# EasyEDA Pro project TBAG_TGT.eprj

# Schematic Schematic1
Create Date: 2024-01-03; Page Name: P1; Project Name: test; Schematic Name: Schematic1; Update Date: 2024-01-03; Company: EasyEDA.com; Drawed: EasyEDA Pro; Page Size: A4; Part Number: JLCPCB-002; Reviewed: EasyEDA Pro; Version: V0.1
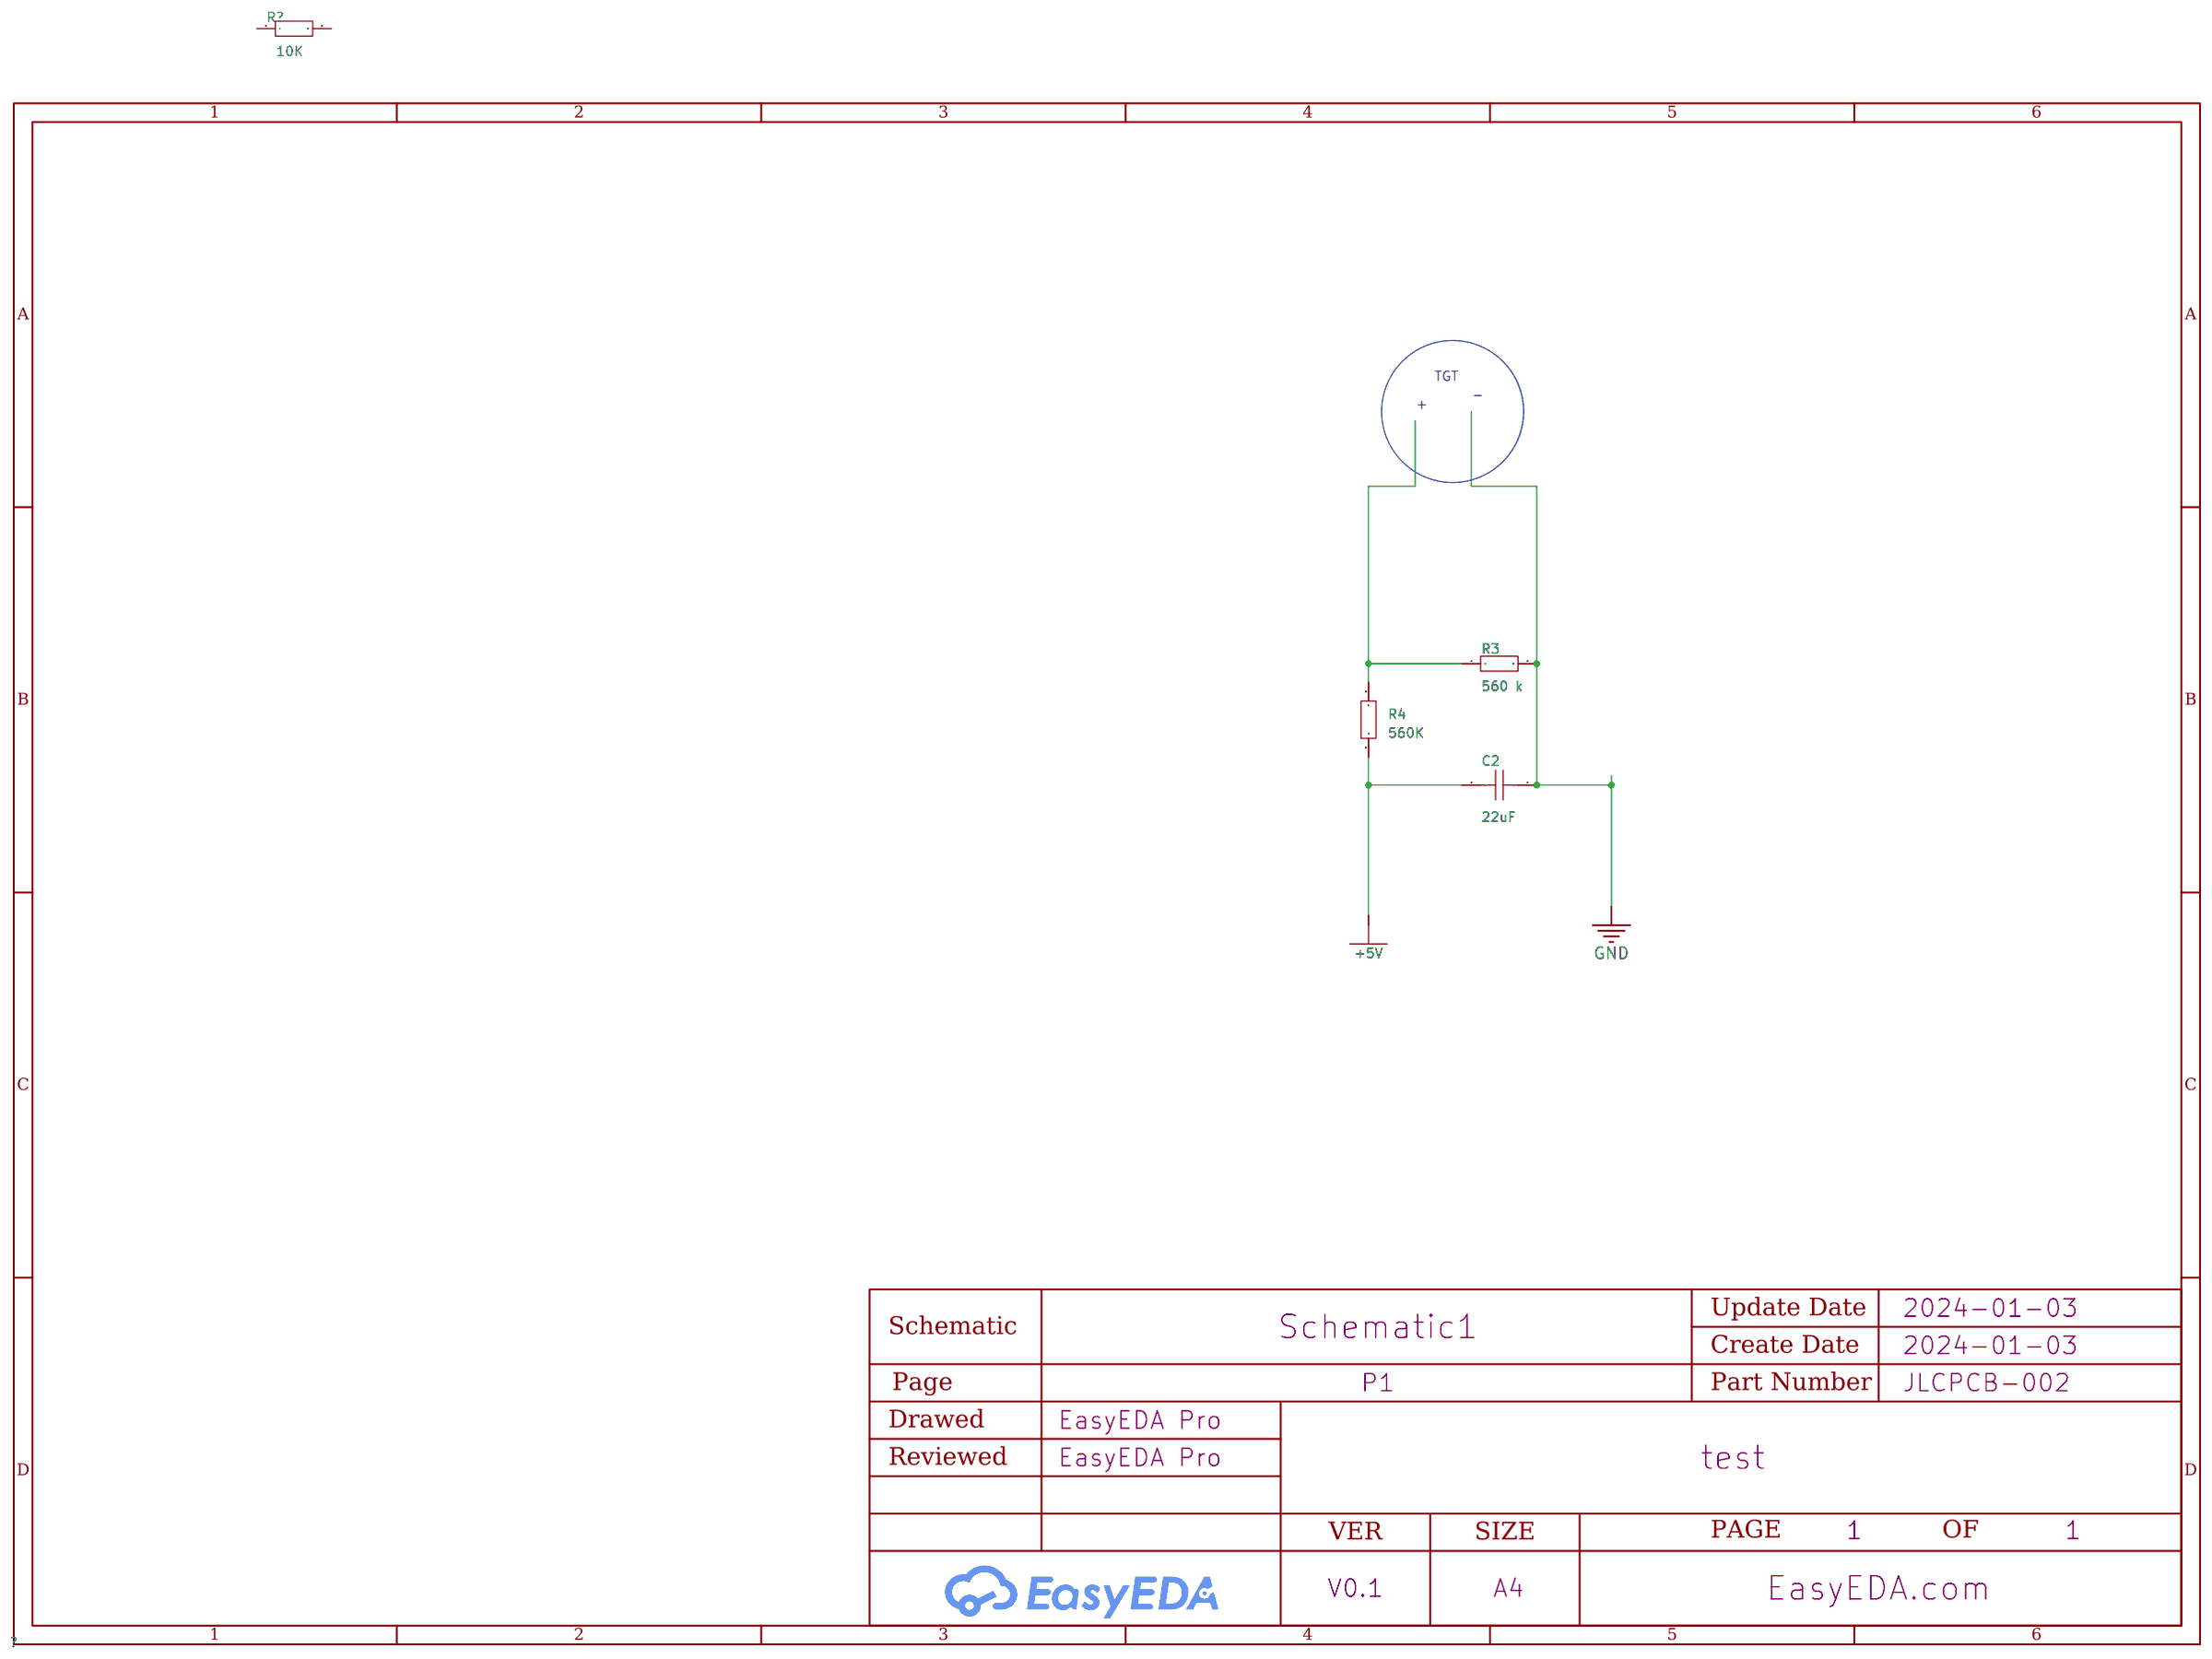
[diagram p0: schematic sheet]

## Parts
C2  22uF  [C0603]
R3  560 k  [R0603]
R4  560K  [R0603]
R?#1  10K  [R0603]

## Library data of the parts
C2 = CAP_0603: Supplier Footprint: 0603
R3 R4 R?#1 = Res_0603: Supplier Footprint: 0603

## Nets
+5V: C2.2 R4.1
GND: C2.1 R3.2
Net-(R3-1): R3.1 R4.2

Not connected (* = marked no-connect by the designer): R?#1 1 2

## Notes on the sheet
- TGT
- -
- +

# Schematic Schematic2
Create Date: 2024-01-03; Page Name: RPM; Project Name: TBAG_TGT; Schematic Name: Schematic2; Update Date: 2024-01-03; Company: EasyEDA.com; Drawed: EasyEDA Pro; Page Size: A4; Part Number: JLCPCB-002; Reviewed: EasyEDA Pro; Version: V0.1
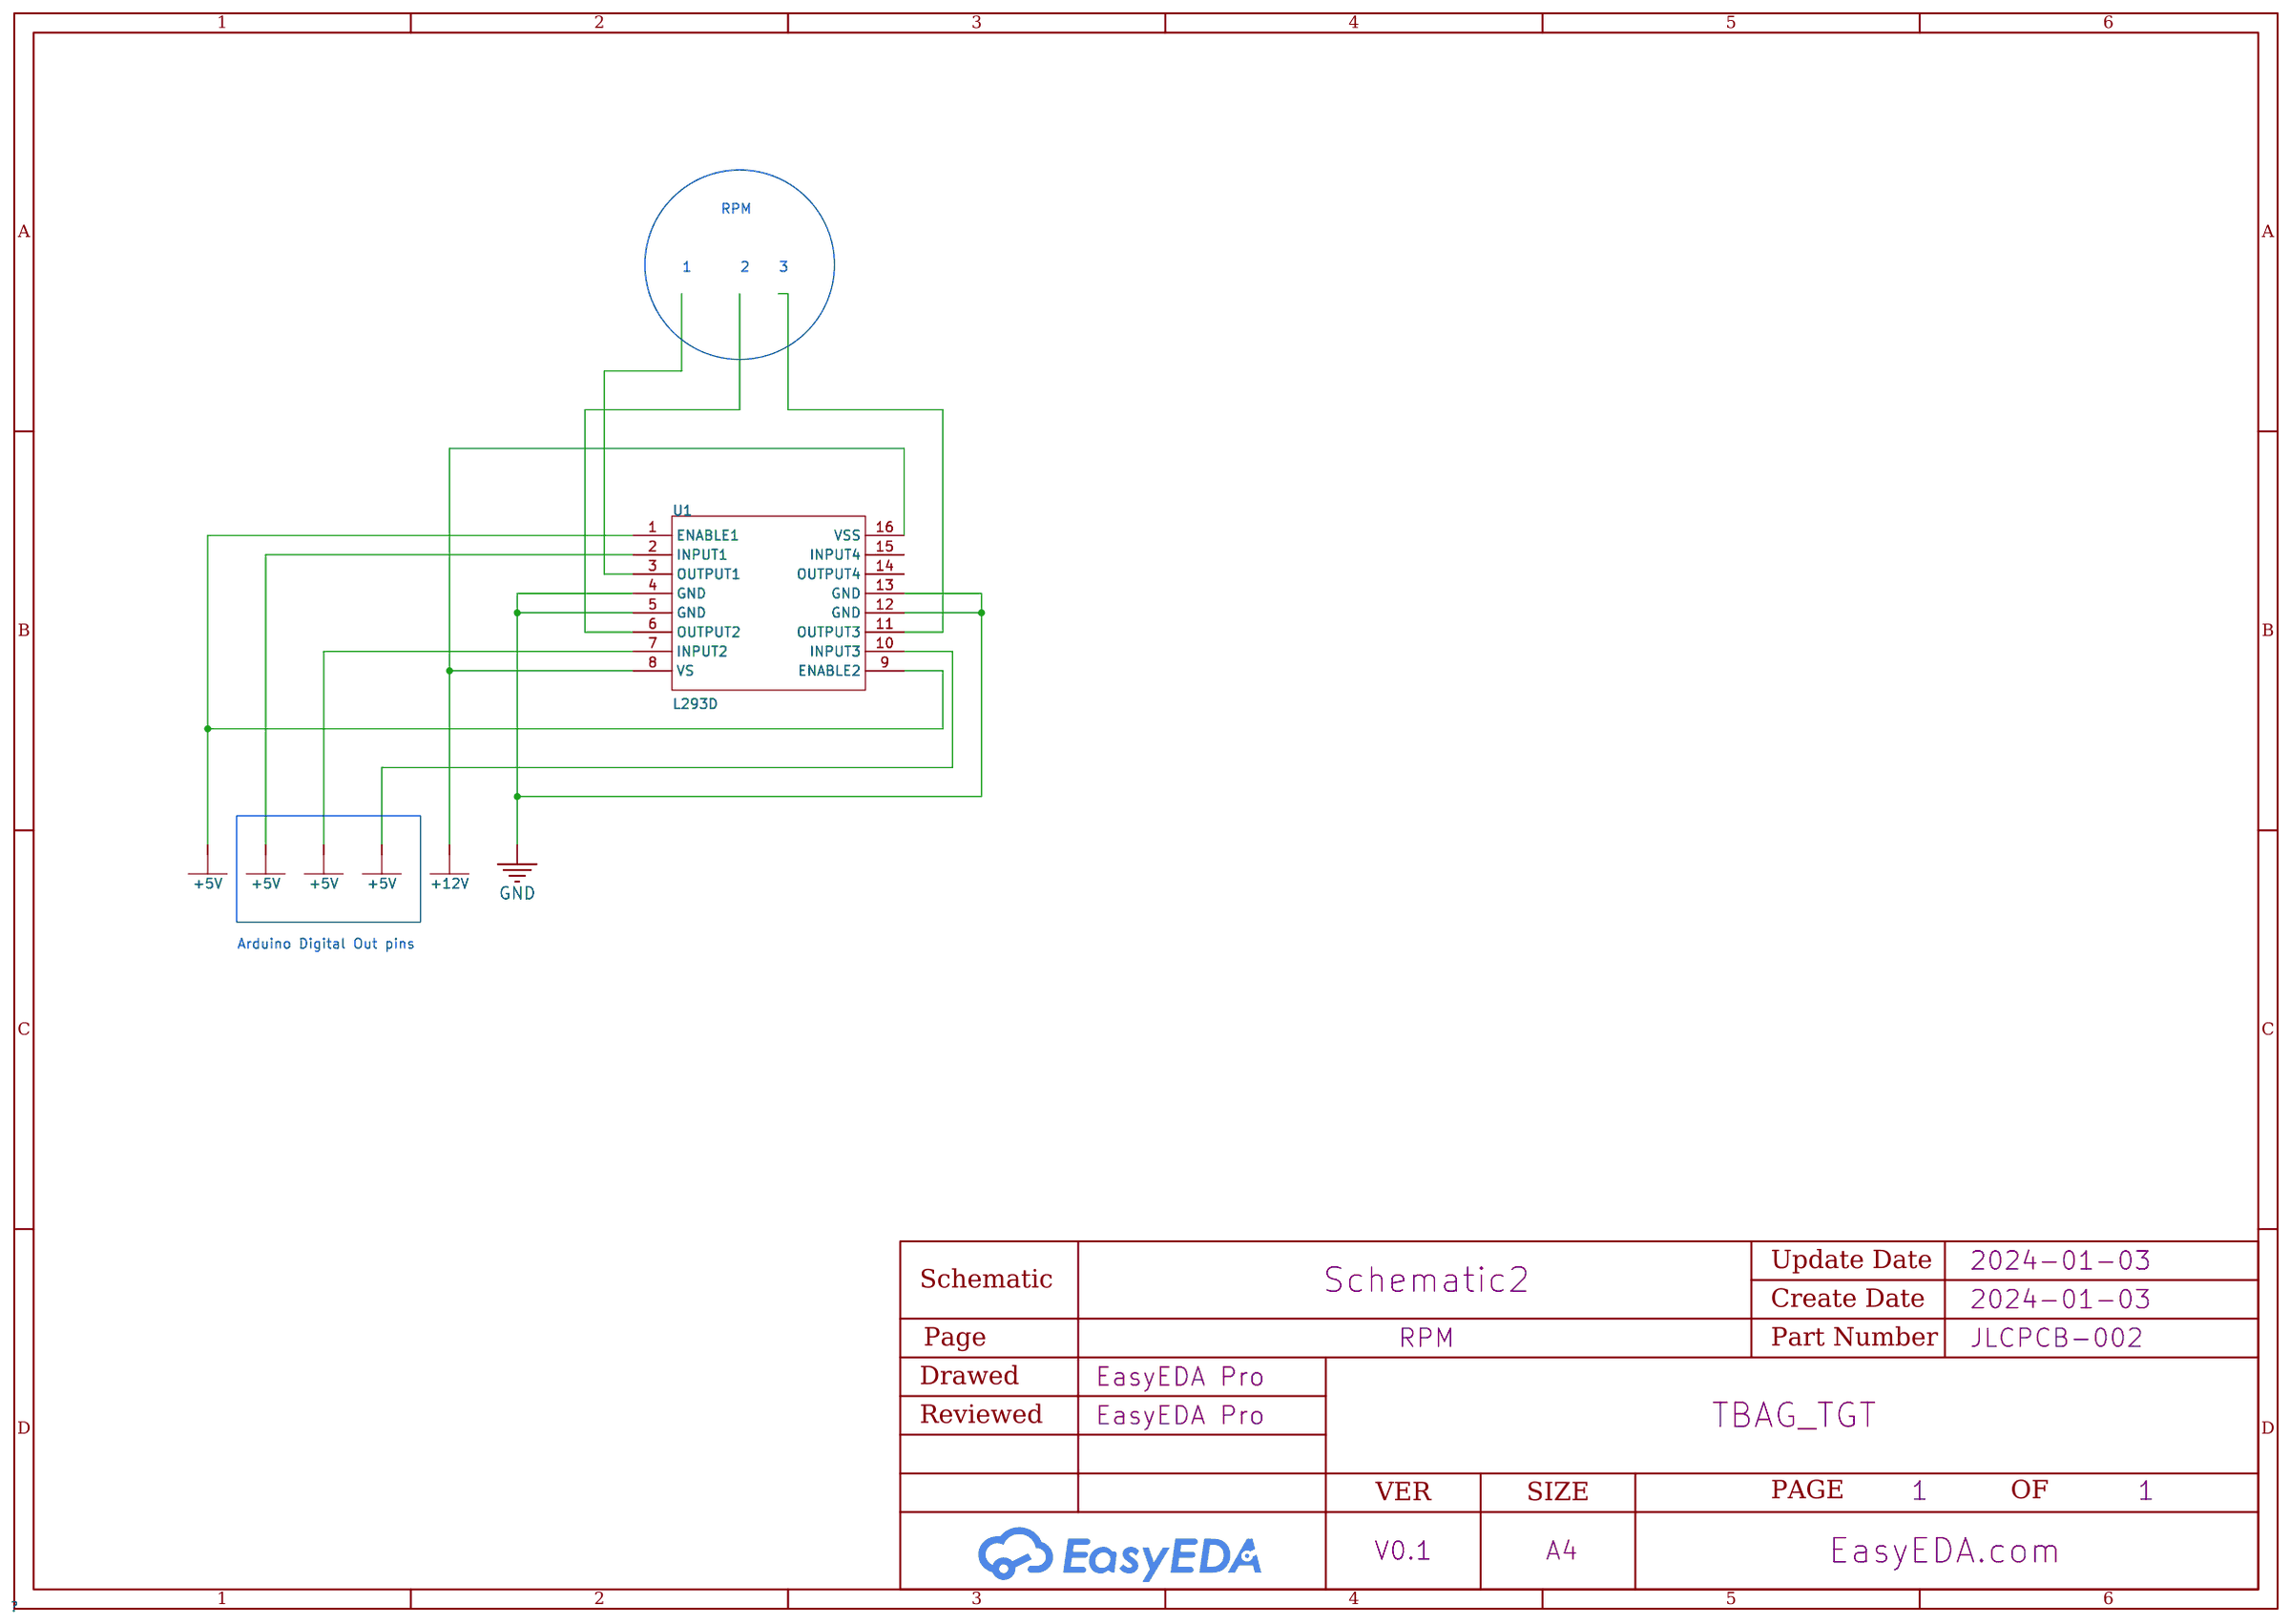
[diagram p1: schematic sheet]

## Parts
U1  L293D  [DIP-16_L20.0-W6.4-P2.54-LS7.6-BL]

## Library data of the parts
U1 = L293D_C12340: Type:有刷直流电机 Supply Voltage:4.5V~36V Supply Voltage:4.5V~36V Output Current:600mA Interface:Parallel Operating Temperature:-40℃~+150℃@(Tj) Operating Temperature:-40℃~+150℃@(Tj); LCSC Part Name: 600mA 有刷直流电机驱动芯片 36V; Supplier Part: C12340; Manufacturer: ST(意法半导体); Supplier Footprint: DIP-16; JLCPCB Part Class: Extended Part; Datasheet: https://atta.szlcsc.com/upload/public/pdf/source/20140724/1457707157802.pdf; Supplier: LCSC; Type: 有刷直流电机; Supply Voltage: 4.5V~36V; Output Current: 600mA; Interface: Parallel; Operating Temperature: -40℃~+150℃@(Tj)

## Nets
+5V: U1.1(ENABLE1) U1.2(INPUT1) U1.7(INPUT2) U1.9(ENABLE2) U1.10(INPUT3)
+12V: U1.8(VS) U1.16(VSS)
GND: U1.4(GND) U1.5(GND) U1.12(GND) U1.13(GND)

Not connected (* = marked no-connect by the designer): U1 3(OUTPUT1) 6(OUTPUT2) 11(OUTPUT3) 14(OUTPUT4) 15(INPUT4)

## Notes on the sheet
- RPM
- 1
- 2
- 3
- Arduino Digital Out pins
